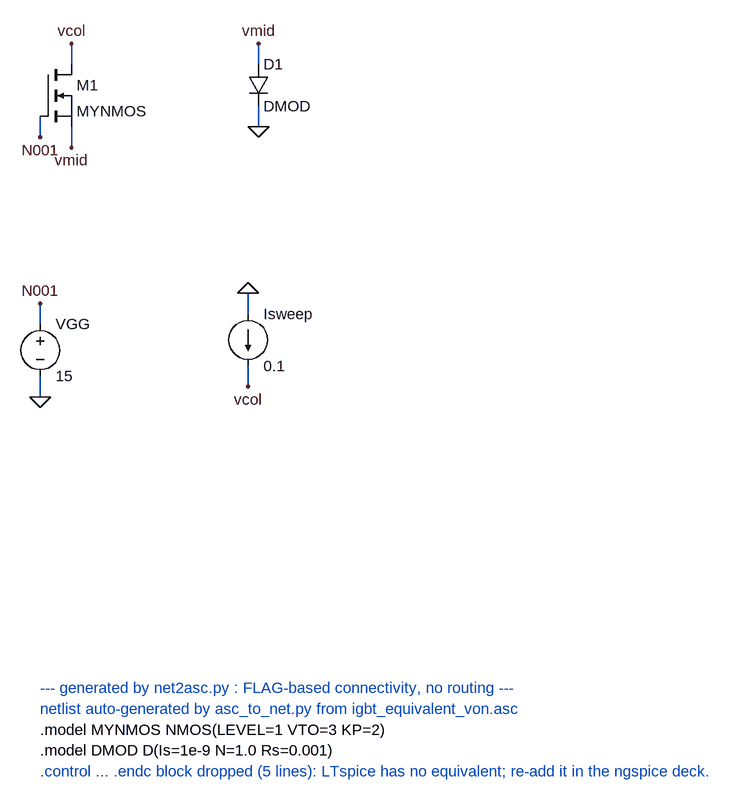
[diagram p0: schematic igbt_equivalent_von.asc]
igbt_equivalent_von.asc, the LTspice schematic file:
Version 4
SHEET 1 880 1288
WIRE 48 0 48 -32
WIRE 0 80 0 112
WIRE 48 96 48 128
WIRE 336 0 336 -32
WIRE 336 64 336 96
WIRE 0 400 0 368
WIRE 0 480 0 512
WIRE 320 384 320 352
WIRE 320 464 320 496
FLAG 48 -32 vcol
FLAG 0 112 N001
FLAG 48 128 vmid
FLAG 336 -32 vmid
FLAG 336 96 0
FLAG 0 368 N001
FLAG 0 512 0
FLAG 320 352 0
FLAG 320 496 vcol
SYMBOL nmos 0 0 R0
SYMATTR InstName M1
SYMATTR Value MYNMOS
SYMBOL diode 320 0 R0
SYMATTR InstName D1
SYMATTR Value DMOD
SYMBOL voltage 0 384 R0
SYMATTR InstName VGG
SYMATTR Value 15
SYMBOL current 320 384 R0
SYMATTR InstName Isweep
SYMATTR Value 0.1
TEXT 0 960 Left 2 ;--- generated by net2asc.py : FLAG-based connectivity, no routing ---
TEXT 0 992 Left 2 ;netlist auto-generated by asc_to_net.py from igbt_equivalent_von.asc
TEXT 0 1024 Left 2 !.model MYNMOS NMOS(LEVEL=1 VTO=3 KP=2)
TEXT 0 1056 Left 2 !.model DMOD D(Is=1e-9 N=1.0 Rs=0.001)
TEXT 0 1088 Left 2 ;.control ... .endc block dropped (5 lines): LTspice has no equivalent; re-add it in the ngspice deck.

The netlist it stands for:
* igbt_equivalent_von.asc
M1 vcol N001 vmid vmid MYNMOS
D1 vmid 0 DMOD
VGG N001 0 15
Isweep 0 vcol 0.1
.model D D
.lib standard.dio
.model NMOS NMOS
.model PMOS PMOS
.lib standard.mos
* --- generated by net2asc.py : FLAG-based connectivity, no routing ---
* netlist auto-generated by asc_to_net.py from igbt_equivalent_von.asc
.model MYNMOS NMOS(LEVEL=1 VTO=3 KP=2)
.model DMOD D(Is=1e-9 N=1.0 Rs=0.001)
* .control ... .endc block dropped (5 lines): LTspice has no equivalent; re-add it in the ngspice deck.
.backanno
.end